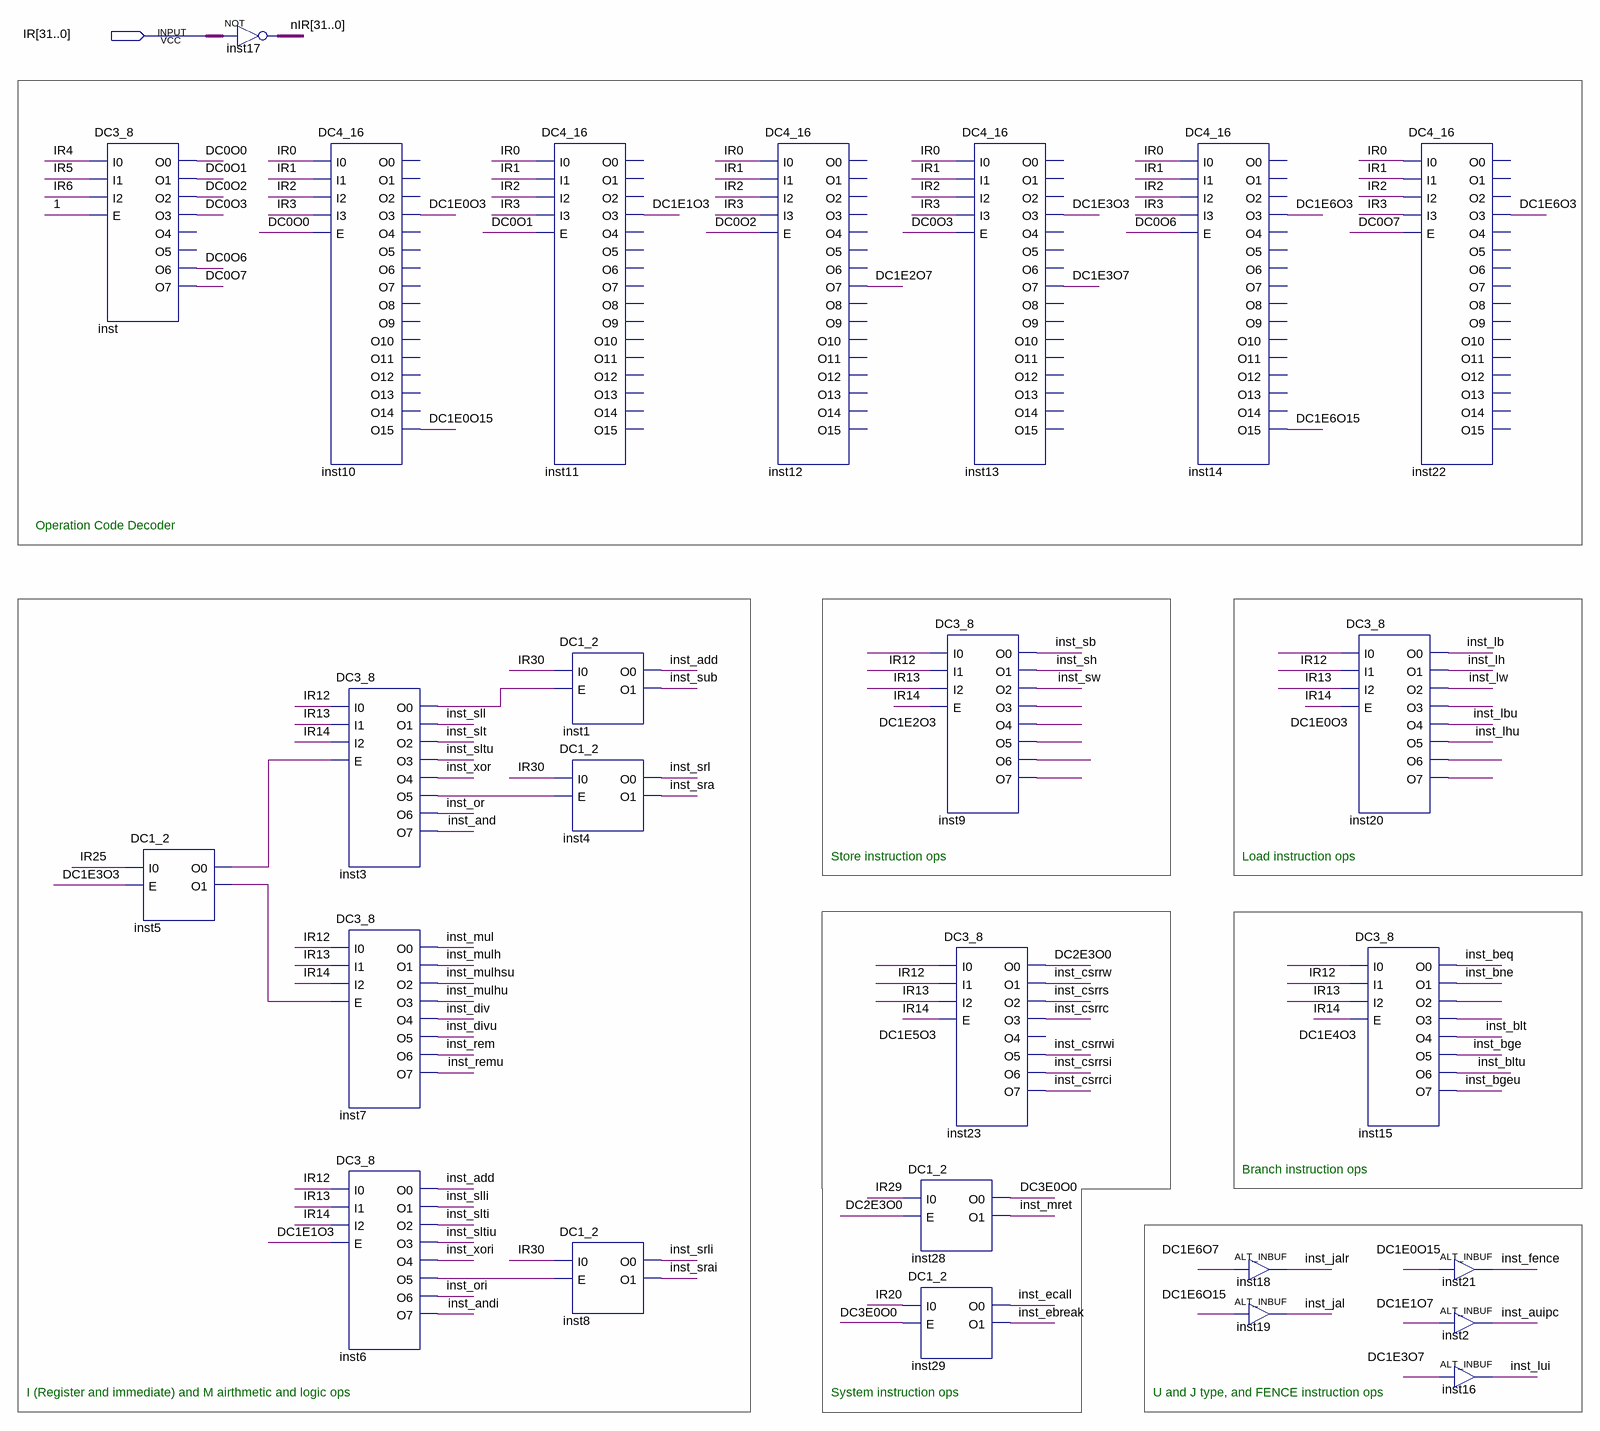
[diagram p0: schematic sheet]
// Quartus schematic ControlUnit.bdf as structural Verilog: 26 symbols, 1 pins
module ControlUnit (
  input  [31:0] IR
);

  wire \1 , DC0O0, DC0O1, DC0O2, DC0O3, DC0O6, DC0O7, DC1E0O3, DC1E0O15, DC1E1O3, DC1E1O7, DC1E2O3, DC1E2O7,
       DC1E3O3, DC1E3O7, DC1E4O3, DC1E5O3, DC1E6O3, DC1E6O7, DC1E6O15, DC2E3O0, DC3E0O0, inst3_o0, inst3_o5,
       inst5_o0, inst5_o1, inst6_o5, inst9_o3, inst9_o4, inst9_o5, inst9_o6, inst9_o7, inst15_o2, inst15_o3,
       inst20_o3, inst20_o6, inst20_o7, inst_add, inst_and, inst_andi, inst_auipc, inst_beq, inst_bge,
       inst_bgeu, inst_blt, inst_bltu, inst_bne, inst_csrrc, inst_csrrci, inst_csrrs, inst_csrrsi,
       inst_csrrw, inst_csrrwi, inst_div, inst_divu, inst_ebreak, inst_ecall, inst_fence, inst_jal,
       inst_jalr, inst_lb, inst_lbu, inst_lh, inst_lhu, inst_lui, inst_lw, inst_mret, inst_mul, inst_mulh,
       inst_mulhsu, inst_mulhu, inst_or, inst_ori, inst_rem, inst_remu, inst_sb, inst_sh, inst_sll,
       inst_slli, inst_slt, inst_slti, inst_sltiu, inst_sltu, inst_sra, inst_srai, inst_srl, inst_srli,
       inst_sub, inst_sw, inst_xor, inst_xori;
  wire [31:0] nIR;

  DC3_8 inst (
    .I0(IR[4]), .I1(IR[5]), .I2(IR[6]), .E(\1 ), .O0(DC0O0), .O1(DC0O1), .O2(DC0O2), .O3(DC0O3), .O6(DC0O6),
    .O7(DC0O7));  // open: O4, O5
  DC1_2 inst5 (.I0(IR[25]), .E(DC1E3O3), .O0(inst5_o0), .O1(inst5_o1));
  assign nIR = ~IR;  // NOT inst17, 32 bits wide
  DC4_16 inst10 (
    .I0(IR[0]), .I1(IR[1]), .I2(IR[2]), .I3(IR[3]), .E(DC0O0), .O3(DC1E0O3), .O15(DC1E0O15));  // open: O0, O1, O2, O4, O5, O6, O7, O8, O9, O10, O11, O12, O13, O14
  DC3_8 inst3 (
    .I0(IR[12]), .I1(IR[13]), .I2(IR[14]), .E(inst5_o0), .O0(inst3_o0), .O1(inst_sll), .O2(inst_slt),
    .O3(inst_sltu), .O4(inst_xor), .O5(inst3_o5), .O6(inst_or), .O7(inst_and));
  DC3_8 inst7 (
    .I0(IR[12]), .I1(IR[13]), .I2(IR[14]), .E(inst5_o1), .O0(inst_mul), .O1(inst_mulh), .O2(inst_mulhsu),
    .O3(inst_mulhu), .O4(inst_div), .O5(inst_divu), .O6(inst_rem), .O7(inst_remu));
  DC3_8 inst6 (
    .I0(IR[12]), .I1(IR[13]), .I2(IR[14]), .E(DC1E1O3), .O0(inst_add), .O1(inst_slli), .O2(inst_slti),
    .O3(inst_sltiu), .O4(inst_xori), .O5(inst6_o5), .O6(inst_ori), .O7(inst_andi));
  DC4_16 inst11 (
    .I0(IR[0]), .I1(IR[1]), .I2(IR[2]), .I3(IR[3]), .E(DC0O1), .O3(DC1E1O3));  // open: O0, O1, O2, O4, O5, O6, O7, O8, O9, O10, O11, O12, O13, O14, O15
  DC1_2 inst1 (.I0(IR[30]), .E(inst3_o0), .O0(inst_add), .O1(inst_sub));
  DC1_2 inst4 (.I0(IR[30]), .E(inst3_o5), .O0(inst_srl), .O1(inst_sra));
  DC1_2 inst8 (.I0(IR[30]), .E(inst6_o5), .O0(inst_srli), .O1(inst_srai));
  DC4_16 inst12 (
    .I0(IR[0]), .I1(IR[1]), .I2(IR[2]), .I3(IR[3]), .E(DC0O2), .O7(DC1E2O7));  // open: O0, O1, O2, O3, O4, O5, O6, O8, O9, O10, O11, O12, O13, O14, O15
  DC4_16 inst13 (
    .I0(IR[0]), .I1(IR[1]), .I2(IR[2]), .I3(IR[3]), .E(DC0O3), .O3(DC1E3O3), .O7(DC1E3O7));  // open: O0, O1, O2, O4, O5, O6, O8, O9, O10, O11, O12, O13, O14, O15
  DC3_8 inst9 (
    .I0(IR[12]), .I1(IR[13]), .I2(IR[14]), .E(DC1E2O3), .O0(inst_sb), .O1(inst_sh), .O2(inst_sw),
    .O3(inst9_o3), .O4(inst9_o4), .O5(inst9_o5), .O6(inst9_o6), .O7(inst9_o7));
  DC3_8 inst23 (
    .I0(IR[12]), .I1(IR[13]), .I2(IR[14]), .E(DC1E5O3), .O0(DC2E3O0), .O1(inst_csrrw), .O2(inst_csrrs),
    .O3(inst_csrrc), .O5(inst_csrrwi), .O6(inst_csrrsi), .O7(inst_csrrci));  // open: O4
  DC1_2 inst28 (.I0(IR[29]), .E(DC2E3O0), .O0(DC3E0O0), .O1(inst_mret));
  DC1_2 inst29 (.I0(IR[20]), .E(DC3E0O0), .O0(inst_ecall), .O1(inst_ebreak));
  DC4_16 inst14 (
    .I0(IR[0]), .I1(IR[1]), .I2(IR[2]), .I3(IR[3]), .E(DC0O6), .O3(DC1E6O3), .O15(DC1E6O15));  // open: O0, O1, O2, O4, O5, O6, O7, O8, O9, O10, O11, O12, O13, O14
  ALT_INBUF inst18 (.i(DC1E6O7), .o(inst_jalr));
  ALT_INBUF inst19 (.i(DC1E6O15), .o(inst_jal));
  DC3_8 inst20 (
    .I0(IR[12]), .I1(IR[13]), .I2(IR[14]), .E(DC1E0O3), .O0(inst_lb), .O1(inst_lh), .O2(inst_lw),
    .O3(inst20_o3), .O4(inst_lbu), .O5(inst_lhu), .O6(inst20_o6), .O7(inst20_o7));
  DC3_8 inst15 (
    .I0(IR[12]), .I1(IR[13]), .I2(IR[14]), .E(DC1E4O3), .O0(inst_beq), .O1(inst_bne), .O2(inst15_o2),
    .O3(inst15_o3), .O4(inst_blt), .O5(inst_bge), .O6(inst_bltu), .O7(inst_bgeu));
  DC4_16 inst22 (
    .I0(IR[0]), .I1(IR[1]), .I2(IR[2]), .I3(IR[3]), .E(DC0O7), .O3(DC1E6O3));  // open: O0, O1, O2, O4, O5, O6, O7, O8, O9, O10, O11, O12, O13, O14, O15
  ALT_INBUF inst21 (.i(DC1E0O15), .o(inst_fence));
  ALT_INBUF inst2 (.i(DC1E1O7), .o(inst_auipc));
  ALT_INBUF inst16 (.i(DC1E3O7), .o(inst_lui));

  // Notes on the sheet:
  //   Operation Code Decoder
  //   Store instruction ops
  //   Load instruction ops
  //   Branch instruction ops
  //   I (Register and immediate) and M airthmetic and logic ops
  //   System instruction ops
  //   U and J type, and FENCE instruction ops
endmodule
